# EAGLE design pc (EAGLE 9.6.2)
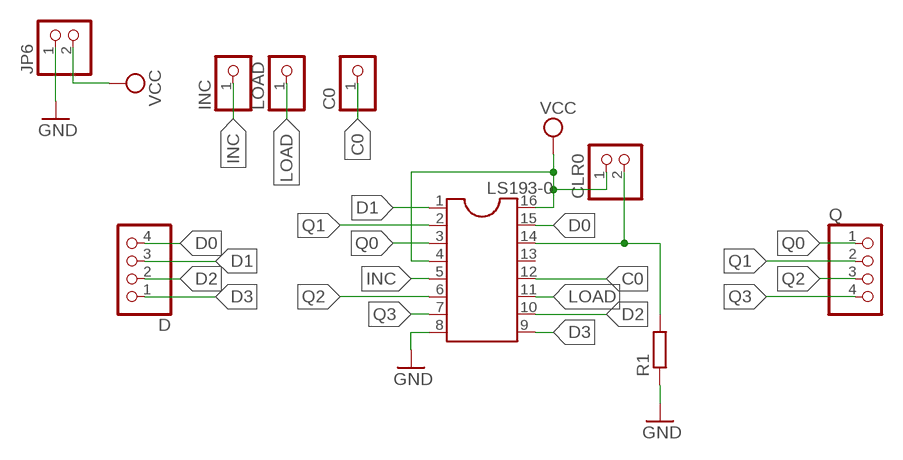
[diagram p0: schematic, sheet 1]

## Parts
C0  PINHD-1X1  [1X01]
CLR0  PINHD-1X2  [1X02]
D  PINHD-1X4  [1X04]
INC  PINHD-1X1  [1X01]
JP6  PINHD-1X2  [1X02]
LOAD  PINHD-1X1  [1X01]
LS193-0  DIL16S  [SOCKET-16]
Q  PINHD-1X4  [1X04]
R1  R-EU_0204/7  [0204/7]

## Nets
C0: C0.1 LS193-0.12
CLR-0: CLR0.2 LS193-0.14 R1.2
D0: D.4 LS193-0.15
D1: D.3 LS193-0.1
D2: D.2 LS193-0.10
D3: D.1 LS193-0.9
GND: JP6.1 LS193-0.8 R1.1
INC: INC.1 LS193-0.5
LOAD: LOAD.1 LS193-0.11
Q0: LS193-0.3 Q.1
Q1: LS193-0.2 Q.2
Q2: LS193-0.6 Q.3
Q3: LS193-0.7 Q.4
VCC: CLR0.1 JP6.2 LS193-0.4 LS193-0.16
Unconnected: LS193-0.13

## Library data of the parts
C0 INC LOAD = pinhead:PINHD-1X1: PIN HEADER
CLR0 JP6 = pinhead:PINHD-1X2: PIN HEADER
D Q = pinhead:PINHD-1X4: PIN HEADER
LS193-0 = ic-package:DIL16: Dual In Line / Socket
R1 = rcl:R-EU_: RESISTOR, European symbol; SPICEPREFIX: R

## Board
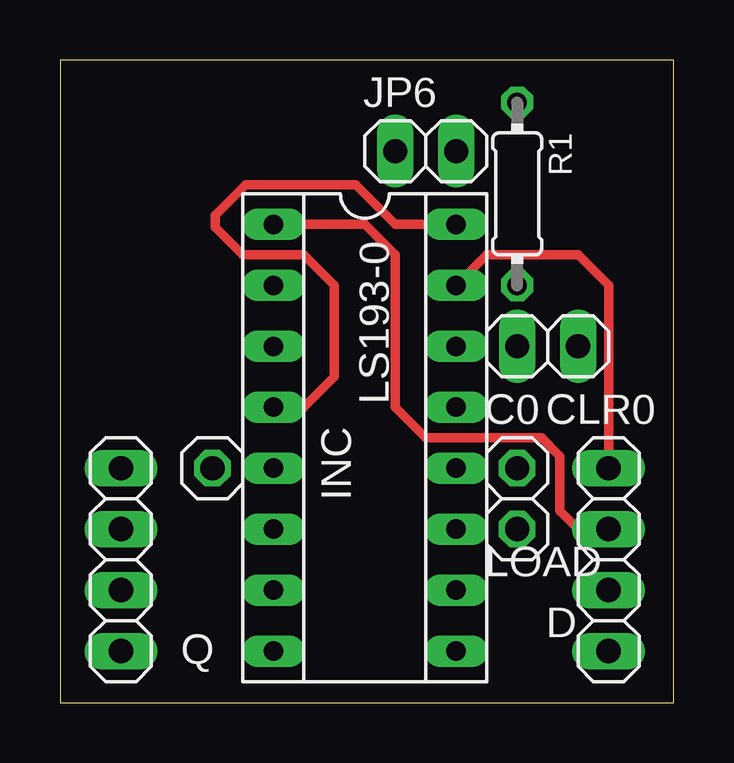
[diagram p1: board, top side]
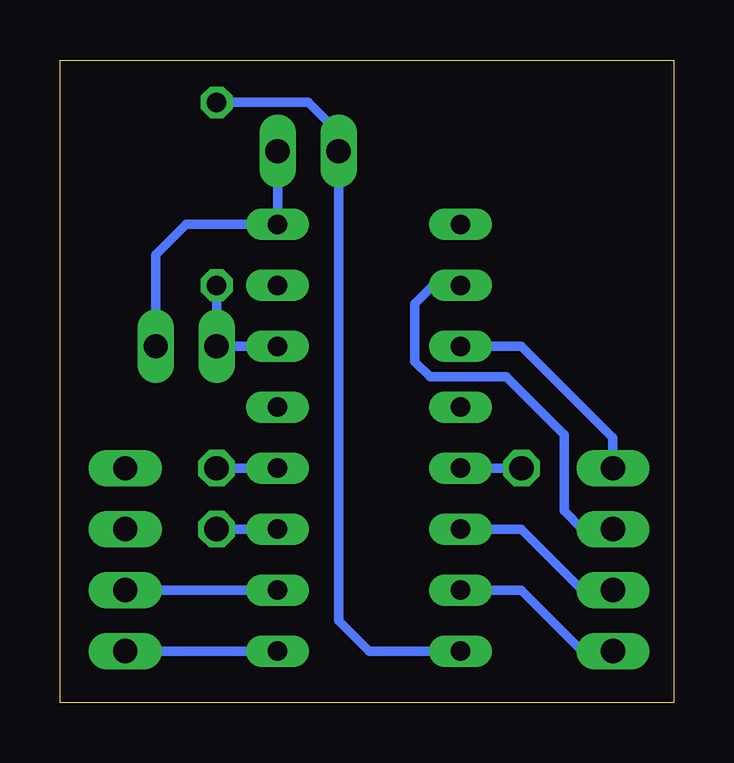
[diagram p2: board, bottom side, seen from below]

Size 25.58 x 26.79 mm. Coordinates in mm from the lower left corner, seen from the top.
Outline: 0,0 25.58,0 25.58,26.79 0,26.79 0,0
Copper layers (1*16): Top 0.035mm / dielectric 1.5mm / Bottom 0.035mm
Design rules "default": minimum track width 6mil, minimum drill 0.35mm, track to track 6mil, track to pad 6mil, pad to pad 6mil, via to via 6mil, smd to smd 6mil, copper to edge 40mil, drill to drill 6mil, minimum pad ring 10mil, minimum via ring 8mil, stop-mask expansion 4mil, vias tented up to drill 0mil, thermal gap 10mil

### Footprints (pad centres in the part's own frame; a part is rotated, then mirrored left to right if it is on the bottom)
1X01 = drill 1.016 octagon: 1 0,0
1X02 = drill 1.016 long: 1 -1.27,0; 2 1.27,0
1X04 = drill 1.016 long: 1 -3.81,0; 2 -1.27,0; 3 1.27,0; 4 3.81,0
SOCKET-16 = drill 0.813 long: 1 -8.89,-3.81; 2 -6.35,-3.81; 3 -3.81,-3.81; 4 -1.27,-3.81; 5 1.27,-3.81; 6 3.81,-3.81; 7 6.35,-3.81; 8 8.89,-3.81; 9 8.89,3.81; 10 6.35,3.81; 11 3.81,3.81; 12 1.27,3.81; 13 -1.27,3.81; 14 -3.81,3.81; 15 -6.35,3.81; 16 -8.89,3.81
0204/7 = drill 0.813 octagon: 1 -3.81,0; 2 3.81,0

### Placement (x,y rotation side)
C0  19.05,9.78 0 top
CLR0  20.32,14.86 180 top
D  22.86,5.97 90 top
INC  6.35,9.78 0 top
JP6  15.24,22.99 0 top
LOAD  19.05,7.24 0 top
LS193-0  12.7,11.05 270 top
Q  2.54,5.97 270 top
R1  19.05,21.21 270 top

### Tracks (layer width: path | path; a pad name or v marks a point on that pad's centre or on a via)
C0
  Bottom 0.4: C0.1 LS193-0.12
CLR-0
  Bottom 0.4: R1.2 CLR0.2 LS193-0.14
D0
  Top 0.4: LS193-0.15 17.78,18.67 21.59,18.67 22.86,17.4 D.4
D1
  Top 0.4: D.3 21.59,7.24 20.83,8 20.83,10.29 20.07,11.05 15.24,11.05 13.97,12.32 13.97,18.67 12.7,19.94 LS193-0.1
D2
  Bottom 0.4: D.2 LS193-0.10
D3
  Bottom 0.4: LS193-0.9 D.1
GND
  Bottom 0.4: R1.1 15.24,25.02 13.97,23.75 JP6.1 13.97,3.43 12.7,2.16 LS193-0.8
INC
  Bottom 0.4: INC.1 LS193-0.5
LOAD
  Bottom 0.4: LS193-0.11 LOAD.1
Q0
  Bottom 0.4: Q.1 2.54,11.05 6.35,14.86 LS193-0.3
Q1
  Bottom 0.4: Q.2 3.81,7.24 4.57,8 4.57,11.18 6.98,13.59 10.16,13.59 10.8,14.22 10.8,16.64 10.03,17.4 LS193-0.2
Q2
  Bottom 0.4: Q.3 3.81,4.7 6.35,7.24 LS193-0.6
Q3
  Bottom 0.4: LS193-0.7 6.35,4.7 3.81,2.16 Q.4
VCC
  Top 0.4: LS193-0.4 10.16,12.32 11.43,13.59 11.43,17.4 10.16,18.67 7.62,18.67 6.48,19.81 6.48,20.32 7.75,21.59 12.32,21.59 13.97,19.94 LS193-0.16
  Bottom 0.4: CLR0.1 21.59,18.67 20.32,19.94 LS193-0.16 JP6.2